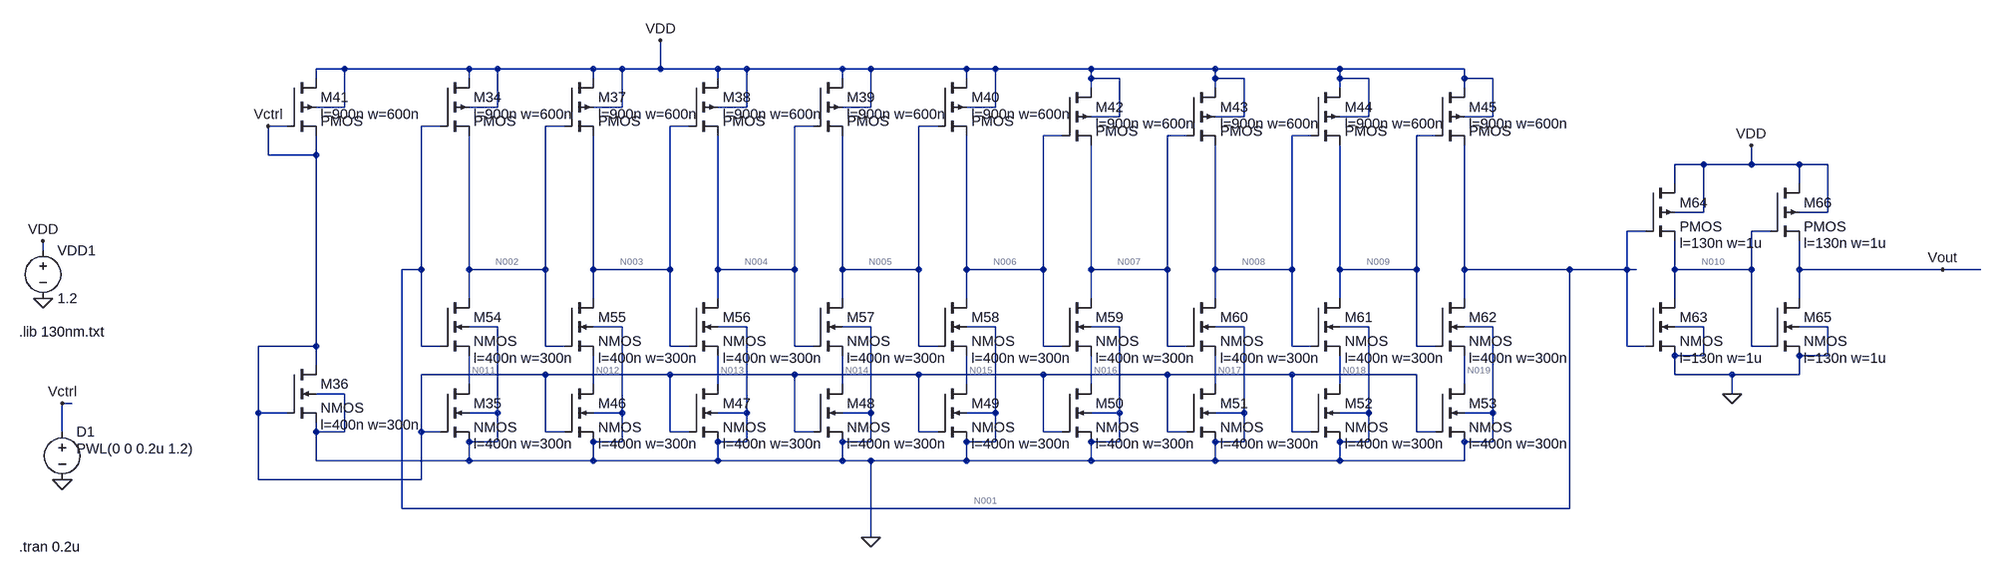
[diagram p0: schematic VCO2.asc]
VCO2.asc, the LTspice schematic file:
Version 4
SHEET 1 3924 1716
WIRE -432 -1168 -480 -1168
WIRE -224 -1168 -432 -1168
WIRE -176 -1168 -224 -1168
WIRE -16 -1168 -176 -1168
WIRE 32 -1168 -16 -1168
WIRE 96 -1168 96 -1216
WIRE 96 -1168 32 -1168
WIRE 192 -1168 96 -1168
WIRE 240 -1168 192 -1168
WIRE 400 -1168 240 -1168
WIRE 448 -1168 400 -1168
WIRE 608 -1168 448 -1168
WIRE 656 -1168 608 -1168
WIRE 816 -1168 656 -1168
WIRE 1024 -1168 816 -1168
WIRE 1232 -1168 1024 -1168
WIRE 1440 -1168 1232 -1168
WIRE -480 -1152 -480 -1168
WIRE -224 -1152 -224 -1168
WIRE -16 -1152 -16 -1168
WIRE 192 -1152 192 -1168
WIRE 400 -1152 400 -1168
WIRE 608 -1152 608 -1168
WIRE 816 -1152 816 -1168
WIRE 864 -1152 816 -1152
WIRE 1024 -1152 1024 -1168
WIRE 1072 -1152 1024 -1152
WIRE 1232 -1152 1232 -1168
WIRE 1280 -1152 1232 -1152
WIRE 1440 -1152 1440 -1168
WIRE 1488 -1152 1440 -1152
WIRE 816 -1136 816 -1152
WIRE 1024 -1136 1024 -1152
WIRE 1232 -1136 1232 -1152
WIRE 1440 -1136 1440 -1152
WIRE -432 -1104 -432 -1168
WIRE -432 -1104 -480 -1104
WIRE -176 -1104 -176 -1168
WIRE -176 -1104 -224 -1104
WIRE 32 -1104 32 -1168
WIRE 32 -1104 -16 -1104
WIRE 240 -1104 240 -1168
WIRE 240 -1104 192 -1104
WIRE 448 -1104 448 -1168
WIRE 448 -1104 400 -1104
WIRE 656 -1104 656 -1168
WIRE 656 -1104 608 -1104
WIRE 864 -1088 864 -1152
WIRE 864 -1088 816 -1088
WIRE 1072 -1088 1072 -1152
WIRE 1072 -1088 1024 -1088
WIRE 1280 -1088 1280 -1152
WIRE 1280 -1088 1232 -1088
WIRE 1488 -1088 1488 -1152
WIRE 1488 -1088 1440 -1088
WIRE -528 -1072 -560 -1072
WIRE -272 -1072 -304 -1072
WIRE -64 -1072 -96 -1072
WIRE 144 -1072 112 -1072
WIRE 352 -1072 320 -1072
WIRE 560 -1072 528 -1072
WIRE 768 -1056 736 -1056
WIRE 976 -1056 944 -1056
WIRE 1184 -1056 1152 -1056
WIRE 1392 -1056 1360 -1056
WIRE -560 -1024 -560 -1072
WIRE -480 -1024 -480 -1056
WIRE -480 -1024 -560 -1024
WIRE 1840 -1008 1792 -1008
WIRE 1920 -1008 1920 -1040
WIRE 1920 -1008 1840 -1008
WIRE 2000 -1008 1920 -1008
WIRE 2048 -1008 2000 -1008
WIRE 1792 -976 1792 -1008
WIRE 2000 -976 2000 -1008
WIRE 1840 -928 1840 -1008
WIRE 1840 -928 1792 -928
WIRE 2048 -928 2048 -1008
WIRE 2048 -928 2000 -928
WIRE 1744 -896 1712 -896
WIRE 1952 -896 1920 -896
WIRE -1008 -864 -1008 -880
WIRE -304 -832 -304 -1072
WIRE -304 -832 -336 -832
WIRE -224 -832 -224 -1056
WIRE -96 -832 -96 -1072
WIRE -96 -832 -224 -832
WIRE -16 -832 -16 -1056
WIRE 112 -832 112 -1072
WIRE 112 -832 -16 -832
WIRE 192 -832 192 -1056
WIRE 320 -832 320 -1072
WIRE 320 -832 192 -832
WIRE 400 -832 400 -1056
WIRE 528 -832 528 -1072
WIRE 528 -832 400 -832
WIRE 608 -832 608 -1056
WIRE 736 -832 736 -1056
WIRE 736 -832 608 -832
WIRE 816 -832 816 -1040
WIRE 944 -832 944 -1056
WIRE 944 -832 816 -832
WIRE 1024 -832 1024 -1040
WIRE 1152 -832 1152 -1056
WIRE 1152 -832 1024 -832
WIRE 1232 -832 1232 -1040
WIRE 1360 -832 1360 -1056
WIRE 1360 -832 1232 -832
WIRE 1440 -832 1440 -1040
WIRE 1616 -832 1440 -832
WIRE 1712 -832 1712 -896
WIRE 1712 -832 1616 -832
WIRE 1728 -832 1712 -832
WIRE 1792 -832 1792 -880
WIRE 1920 -832 1920 -896
WIRE 1920 -832 1792 -832
WIRE 2000 -832 2000 -880
WIRE 2240 -832 2000 -832
WIRE 2304 -832 2240 -832
WIRE -224 -784 -224 -832
WIRE -16 -784 -16 -832
WIRE 192 -784 192 -832
WIRE 400 -784 400 -832
WIRE 608 -784 608 -832
WIRE 816 -784 816 -832
WIRE 1024 -784 1024 -832
WIRE 1232 -784 1232 -832
WIRE 1440 -784 1440 -832
WIRE 1792 -784 1792 -832
WIRE 2000 -784 2000 -832
WIRE -176 -736 -224 -736
WIRE 32 -736 -16 -736
WIRE 240 -736 192 -736
WIRE 448 -736 400 -736
WIRE 656 -736 608 -736
WIRE 864 -736 816 -736
WIRE 1072 -736 1024 -736
WIRE 1280 -736 1232 -736
WIRE 1488 -736 1440 -736
WIRE 1840 -736 1792 -736
WIRE 2048 -736 2000 -736
WIRE -480 -704 -480 -1024
WIRE -480 -704 -576 -704
WIRE -304 -704 -304 -832
WIRE -272 -704 -304 -704
WIRE -96 -704 -96 -832
WIRE -64 -704 -96 -704
WIRE 112 -704 112 -832
WIRE 144 -704 112 -704
WIRE 320 -704 320 -832
WIRE 352 -704 320 -704
WIRE 528 -704 528 -832
WIRE 560 -704 528 -704
WIRE 736 -704 736 -832
WIRE 768 -704 736 -704
WIRE 944 -704 944 -832
WIRE 976 -704 944 -704
WIRE 1152 -704 1152 -832
WIRE 1184 -704 1152 -704
WIRE 1360 -704 1360 -832
WIRE 1392 -704 1360 -704
WIRE 1712 -704 1712 -832
WIRE 1744 -704 1712 -704
WIRE 1920 -704 1920 -832
WIRE 1952 -704 1920 -704
WIRE 1840 -688 1840 -736
WIRE 1840 -688 1792 -688
WIRE 2048 -688 2048 -736
WIRE 2048 -688 2000 -688
WIRE -480 -672 -480 -704
WIRE -96 -656 -304 -656
WIRE 112 -656 -96 -656
WIRE 320 -656 112 -656
WIRE 528 -656 320 -656
WIRE 736 -656 528 -656
WIRE 944 -656 736 -656
WIRE 1152 -656 944 -656
WIRE 1360 -656 1152 -656
WIRE 1792 -656 1792 -688
WIRE 1888 -656 1792 -656
WIRE 2000 -656 2000 -688
WIRE 2000 -656 1888 -656
WIRE -224 -640 -224 -688
WIRE -16 -640 -16 -688
WIRE 192 -640 192 -688
WIRE 400 -640 400 -688
WIRE 608 -640 608 -688
WIRE 816 -640 816 -688
WIRE 1024 -640 1024 -688
WIRE 1232 -640 1232 -688
WIRE 1440 -640 1440 -688
WIRE -432 -624 -480 -624
WIRE 1888 -624 1888 -656
WIRE -960 -608 -976 -608
WIRE -576 -592 -576 -704
WIRE -528 -592 -576 -592
WIRE -176 -592 -176 -736
WIRE -176 -592 -224 -592
WIRE 32 -592 32 -736
WIRE 32 -592 -16 -592
WIRE 240 -592 240 -736
WIRE 240 -592 192 -592
WIRE 448 -592 448 -736
WIRE 448 -592 400 -592
WIRE 656 -592 656 -736
WIRE 656 -592 608 -592
WIRE 864 -592 864 -736
WIRE 864 -592 816 -592
WIRE 1072 -592 1072 -736
WIRE 1072 -592 1024 -592
WIRE 1280 -592 1280 -736
WIRE 1280 -592 1232 -592
WIRE 1488 -592 1488 -736
WIRE 1488 -592 1440 -592
WIRE -976 -560 -976 -608
WIRE -480 -560 -480 -576
WIRE -432 -560 -432 -624
WIRE -432 -560 -480 -560
WIRE -304 -560 -304 -656
WIRE -272 -560 -304 -560
WIRE -96 -560 -96 -656
WIRE -64 -560 -96 -560
WIRE 112 -560 112 -656
WIRE 144 -560 112 -560
WIRE 320 -560 320 -656
WIRE 352 -560 320 -560
WIRE 528 -560 528 -656
WIRE 560 -560 528 -560
WIRE 736 -560 736 -656
WIRE 768 -560 736 -560
WIRE 944 -560 944 -656
WIRE 976 -560 944 -560
WIRE 1152 -560 1152 -656
WIRE 1184 -560 1152 -560
WIRE 1360 -560 1360 -656
WIRE 1392 -560 1360 -560
WIRE -176 -544 -176 -592
WIRE -176 -544 -224 -544
WIRE 32 -544 32 -592
WIRE 32 -544 -16 -544
WIRE 240 -544 240 -592
WIRE 240 -544 192 -544
WIRE 448 -544 448 -592
WIRE 448 -544 400 -544
WIRE 656 -544 656 -592
WIRE 656 -544 608 -544
WIRE 864 -544 864 -592
WIRE 864 -544 816 -544
WIRE 1072 -544 1072 -592
WIRE 1072 -544 1024 -544
WIRE 1280 -544 1280 -592
WIRE 1280 -544 1232 -544
WIRE 1488 -544 1488 -592
WIRE 1488 -544 1440 -544
WIRE -480 -512 -480 -560
WIRE -224 -512 -224 -544
WIRE -224 -512 -480 -512
WIRE -16 -512 -16 -544
WIRE -16 -512 -224 -512
WIRE 192 -512 192 -544
WIRE 192 -512 -16 -512
WIRE 400 -512 400 -544
WIRE 400 -512 192 -512
WIRE 448 -512 400 -512
WIRE 608 -512 608 -544
WIRE 608 -512 448 -512
WIRE 816 -512 816 -544
WIRE 816 -512 608 -512
WIRE 1024 -512 1024 -544
WIRE 1024 -512 816 -512
WIRE 1232 -512 1232 -544
WIRE 1232 -512 1024 -512
WIRE 1440 -512 1440 -544
WIRE 1440 -512 1232 -512
WIRE -576 -480 -576 -592
WIRE -304 -480 -304 -560
WIRE -304 -480 -576 -480
WIRE -336 -432 -336 -832
WIRE 1616 -432 1616 -832
WIRE 1616 -432 -336 -432
WIRE 448 -384 448 -512
FLAG -976 -480 0
FLAG -1008 -784 0
FLAG -1008 -880 VDD
FLAG -976 -608 Vctrl
FLAG 96 -1216 VDD
FLAG -560 -1072 Vctrl
FLAG 448 -384 0
FLAG 1888 -624 0
FLAG 1920 -1040 VDD
FLAG 2240 -832 Vout
SYMBOL voltage -976 -576 R0
WINDOW 123 0 0 Left 0
WINDOW 39 24 124 Left 2
WINDOW 3 24 44 Left 2
SYMATTR Value PWL(0 0 0.2u 1.2)
SYMATTR InstName D1
SYMBOL voltage -1008 -880 R0
WINDOW 123 0 0 Left 0
WINDOW 39 24 124 Left 2
SYMATTR InstName VDD1
SYMATTR Value 1.2
SYMBOL pmos4 -272 -1152 R0
WINDOW 123 56 60 Left 2
SYMATTR Value2 l=900n w=600n
SYMATTR InstName M34
SYMBOL nmos4 -272 -640 R0
WINDOW 123 56 100 Left 2
SYMATTR Value2 l=400n w=300n
SYMATTR InstName M35
SYMBOL nmos4 -528 -672 R0
WINDOW 123 56 100 Left 2
SYMATTR Value2 l=400n w=300n
SYMATTR InstName M36
SYMBOL pmos4 -64 -1152 R0
WINDOW 123 56 60 Left 2
SYMATTR Value2 l=900n w=600n
SYMATTR InstName M37
SYMBOL pmos4 144 -1152 R0
WINDOW 123 56 60 Left 2
SYMATTR Value2 l=900n w=600n
SYMATTR InstName M38
SYMBOL pmos4 352 -1152 R0
WINDOW 123 56 60 Left 2
SYMATTR Value2 l=900n w=600n
SYMATTR InstName M39
SYMBOL pmos4 560 -1152 R0
WINDOW 123 56 60 Left 2
SYMATTR Value2 l=900n w=600n
SYMATTR InstName M40
SYMBOL pmos4 -528 -1152 R0
WINDOW 123 56 60 Left 2
SYMATTR Value2 l=900n w=600n
SYMATTR InstName M41
SYMBOL pmos4 768 -1136 R0
WINDOW 123 56 60 Left 2
SYMATTR Value2 l=900n w=600n
SYMATTR InstName M42
SYMBOL pmos4 976 -1136 R0
WINDOW 123 56 60 Left 2
SYMATTR Value2 l=900n w=600n
SYMATTR InstName M43
SYMBOL pmos4 1184 -1136 R0
WINDOW 123 56 60 Left 2
SYMATTR Value2 l=900n w=600n
SYMATTR InstName M44
SYMBOL pmos4 1392 -1136 R0
WINDOW 123 56 60 Left 2
SYMATTR Value2 l=900n w=600n
SYMATTR InstName M45
SYMBOL nmos4 -64 -640 R0
WINDOW 123 56 100 Left 2
SYMATTR Value2 l=400n w=300n
SYMATTR InstName M46
SYMBOL nmos4 144 -640 R0
WINDOW 123 56 100 Left 2
SYMATTR Value2 l=400n w=300n
SYMATTR InstName M47
SYMBOL nmos4 352 -640 R0
WINDOW 123 56 100 Left 2
SYMATTR Value2 l=400n w=300n
SYMATTR InstName M48
SYMBOL nmos4 560 -640 R0
WINDOW 123 56 100 Left 2
SYMATTR Value2 l=400n w=300n
SYMATTR InstName M49
SYMBOL nmos4 768 -640 R0
WINDOW 123 56 100 Left 2
SYMATTR Value2 l=400n w=300n
SYMATTR InstName M50
SYMBOL nmos4 976 -640 R0
WINDOW 123 56 100 Left 2
SYMATTR Value2 l=400n w=300n
SYMATTR InstName M51
SYMBOL nmos4 1184 -640 R0
WINDOW 123 56 100 Left 2
SYMATTR Value2 l=400n w=300n
SYMATTR InstName M52
SYMBOL nmos4 1392 -640 R0
WINDOW 123 56 100 Left 2
SYMATTR Value2 l=400n w=300n
SYMATTR InstName M53
SYMBOL nmos4 -272 -784 R0
WINDOW 123 56 100 Left 2
SYMATTR Value2 l=400n w=300n
SYMATTR InstName M54
SYMBOL nmos4 -64 -784 R0
WINDOW 123 56 100 Left 2
SYMATTR Value2 l=400n w=300n
SYMATTR InstName M55
SYMBOL nmos4 144 -784 R0
WINDOW 123 56 100 Left 2
SYMATTR Value2 l=400n w=300n
SYMATTR InstName M56
SYMBOL nmos4 352 -784 R0
WINDOW 123 56 100 Left 2
SYMATTR Value2 l=400n w=300n
SYMATTR InstName M57
SYMBOL nmos4 560 -784 R0
WINDOW 123 56 100 Left 2
SYMATTR Value2 l=400n w=300n
SYMATTR InstName M58
SYMBOL nmos4 768 -784 R0
WINDOW 123 56 100 Left 2
SYMATTR Value2 l=400n w=300n
SYMATTR InstName M59
SYMBOL nmos4 976 -784 R0
WINDOW 123 56 100 Left 2
SYMATTR Value2 l=400n w=300n
SYMATTR InstName M60
SYMBOL nmos4 1184 -784 R0
WINDOW 123 56 100 Left 2
SYMATTR Value2 l=400n w=300n
SYMATTR InstName M61
SYMBOL nmos4 1392 -784 R0
WINDOW 123 56 100 Left 2
SYMATTR Value2 l=400n w=300n
SYMATTR InstName M62
SYMBOL nmos4 1744 -784 R0
WINDOW 123 56 100 Left 2
SYMATTR Value2 l=130n w=1u
SYMATTR InstName M63
SYMBOL pmos4 1744 -976 R0
WINDOW 123 56 100 Left 2
SYMATTR Value2 l=130n w=1u
SYMATTR InstName M64
SYMBOL nmos4 1952 -784 R0
WINDOW 123 56 100 Left 2
SYMATTR Value2 l=130n w=1u
SYMATTR InstName M65
SYMBOL pmos4 1952 -976 R0
WINDOW 123 56 100 Left 2
SYMATTR Value2 l=130n w=1u
SYMATTR InstName M66
TEXT -1048 -368 Left 2 !.tran 0.2u
TEXT -1048 -728 Left 2 !.lib 130nm.txt

The netlist it stands for:
* VCO2.asc
V§D1 Vctrl 0 PWL(0 0 0.2u 1.2)
VDD1 VDD 0 1.2
M34 VDD N001 N002 VDD PMOS l=900n w=600n
M35 N011 Vctrl 0 0 NMOS l=400n w=300n
M36 Vctrl Vctrl 0 0 NMOS l=400n w=300n
M37 VDD N002 N003 VDD PMOS l=900n w=600n
M38 VDD N003 N004 VDD PMOS l=900n w=600n
M39 VDD N004 N005 VDD PMOS l=900n w=600n
M40 VDD N005 N006 VDD PMOS l=900n w=600n
M41 VDD Vctrl Vctrl VDD PMOS l=900n w=600n
M42 VDD N006 N007 VDD PMOS l=900n w=600n
M43 VDD N007 N008 VDD PMOS l=900n w=600n
M44 VDD N008 N009 VDD PMOS l=900n w=600n
M45 VDD N009 N001 VDD PMOS l=900n w=600n
M46 N012 Vctrl 0 0 NMOS l=400n w=300n
M47 N013 Vctrl 0 0 NMOS l=400n w=300n
M48 N014 Vctrl 0 0 NMOS l=400n w=300n
M49 N015 Vctrl 0 0 NMOS l=400n w=300n
M50 N016 Vctrl 0 0 NMOS l=400n w=300n
M51 N017 Vctrl 0 0 NMOS l=400n w=300n
M52 N018 Vctrl 0 0 NMOS l=400n w=300n
M53 N019 Vctrl 0 0 NMOS l=400n w=300n
M54 N002 N001 N011 0 NMOS l=400n w=300n
M55 N003 N002 N012 0 NMOS l=400n w=300n
M56 N004 N003 N013 0 NMOS l=400n w=300n
M57 N005 N004 N014 0 NMOS l=400n w=300n
M58 N006 N005 N015 0 NMOS l=400n w=300n
M59 N007 N006 N016 0 NMOS l=400n w=300n
M60 N008 N007 N017 0 NMOS l=400n w=300n
M61 N009 N008 N018 0 NMOS l=400n w=300n
M62 N001 N009 N019 0 NMOS l=400n w=300n
M63 N010 N001 0 0 NMOS l=130n w=1u
M64 VDD N001 N010 VDD PMOS l=130n w=1u
M65 Vout N010 0 0 NMOS l=130n w=1u
M66 VDD N010 Vout VDD PMOS l=130n w=1u
.model NMOS NMOS
.model PMOS PMOS
.lib standard.mos
.tran 0.2u
.lib 130nm.txt
.backanno
.end

* Results of the author's LTspice run, read from the files saved beside the schematic
* Operating Point, zero values left out:
*   V(vdd) = 1.2 V
*   V(n001) = 1.138 V
*   V(n002) = 1.138 V
*   V(n011) = 927.5 mV
*   V(n003) = 1.138 V
*   V(n004) = 1.138 V
*   V(n005) = 1.138 V
*   V(n006) = 1.138 V
*   V(n007) = 1.138 V
*   V(n008) = 1.141 V
*   V(n009) = 1.03 V
*   V(n012) = 927.5 mV
*   V(n013) = 927.5 mV
*   V(n014) = 927.5 mV
*   V(n015) = 927.5 mV
*   V(n016) = 927.6 mV
*   V(n017) = 927.3 mV
*   V(n018) = 928.8 mV
*   V(n019) = 839.8 mV
*   V(n010) = 28.28 µV
*   V(vout) = 1.2 V
*   Id(M65) = 23.3 nA
*   Ig(M65) = -719.1 pA
*   Ib(M65) = -1.449 pA
*   Is(M65) = -22.58 nA
*   Id(M63) = 86.36 nA
*   Ig(M63) = 2.264 nA
*   Is(M63) = -88.62 nA
*   Id(M62) = 116.9 pA
*   Ib(M62) = -1.988 pA
*   Is(M62) = -115 pA
*   Id(M61) = 134.1 pA
*   Ib(M61) = -1.969 pA
*   Is(M61) = -132.2 pA
*   Id(M60) = 133.9 pA
*   Ib(M60) = -2.078 pA
*   Is(M60) = -131.9 pA
*   Id(M59) = 133.9 pA
*   Ib(M59) = -2.076 pA
*   Is(M59) = -131.9 pA
*   Id(M58) = 133.9 pA
*   Ib(M58) = -2.076 pA
*   Is(M58) = -131.9 pA
*   Id(M57) = 133.9 pA
*   Ib(M57) = -2.076 pA
*   Is(M57) = -131.9 pA
*   Id(M56) = 133.9 pA
*   Ib(M56) = -2.076 pA
*   Is(M56) = -131.9 pA
*   Id(M55) = 133.9 pA
*   Ib(M55) = -2.076 pA
*   Is(M55) = -131.9 pA
*   Id(M54) = 133.9 pA
*   Ib(M54) = -2.076 pA
*   Is(M54) = -131.9 pA
*   Id(M53) = 115 pA
*   Ig(M53) = -19.15 pA
*   Is(M53) = -94.98 pA
*   Id(M52) = 132.2 pA
*   Ig(M52) = -35.5 pA
*   Is(M52) = -95.77 pA
*   Id(M51) = 131.9 pA
*   Ig(M51) = -35.15 pA
*   Is(M51) = -95.76 pA
*   Id(M50) = 131.9 pA
*   Ig(M50) = -35.2 pA
*   Is(M50) = -95.76 pA
*   Id(M49) = 131.9 pA
*   Ig(M49) = -35.2 pA
*   Is(M49) = -95.76 pA
*   Id(M48) = 131.9 pA
*   Ig(M48) = -35.2 pA
*   Is(M48) = -95.76 pA
*   Id(M47) = 131.9 pA
*   Ig(M47) = -35.2 pA
*   Is(M47) = -95.76 pA
*   Id(M46) = 131.9 pA
*   Ig(M46) = -35.2 pA
*   Is(M46) = -95.76 pA
*   Id(M35) = 131.9 pA
*   Ig(M35) = -35.2 pA
*   Is(M35) = -95.76 pA
*   Id(M66) = 23.31 nA
*   Ig(M66) = -4.714 pA
*   Is(M66) = -23.3 nA
*   Id(M64) = 85.63 nA
*   Ig(M64) = 1.524 pA
*   Ib(M64) = 1.951 pA
*   Is(M64) = -85.64 nA
*   Id(M45) = 2.383 nA
*   Is(M45) = -2.383 nA
*   Id(M44) = 134 pA
*   Is(M44) = -134.1 pA
*   Id(M43) = 133.9 pA
*   Is(M43) = -133.9 pA
*   Id(M42) = 133.9 pA
*   Is(M42) = -134 pA
*   Id(M41) = 15.5 µA
*   Ig(M41) = -6.958 pA
*   Ib(M41) = 6.923 pA
*   Is(M41) = -15.5 µA
*   Id(M40) = 133.9 pA
*   Is(M40) = -134 pA
*   Id(M39) = 133.9 pA
*   Is(M39) = -134 pA
*   Id(M38) = 133.9 pA
*   Is(M38) = -134 pA
*   Id(M37) = 133.9 pA
*   Is(M37) = -134 pA
*   Id(M34) = 133.9 pA
*   Is(M34) = -134 pA
*   I(Vdd1) = -15.61 µA
*   I(D1) = 15.5 µA
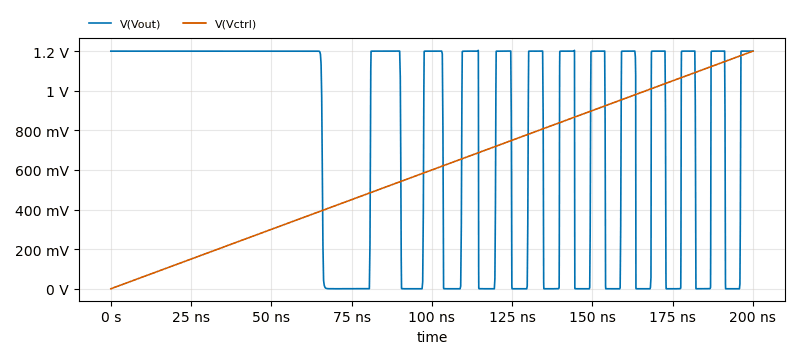
[diagram p1: Transient Analysis of VCO2.asc, plotted from the saved traces]
* Transient Analysis, 1 run:
*   V(Vout): min -199.1 µV, max 1.204 V, average 766.4 mV, rms 954.9 mV, last 1.2 V
*   V(Vctrl): min 0 V, max 1.2 V, average 600 mV, rms 692.9 mV, last 1.2 V